# EAGLE design 32u4 Simple Breakout (EAGLE 7.4.0)
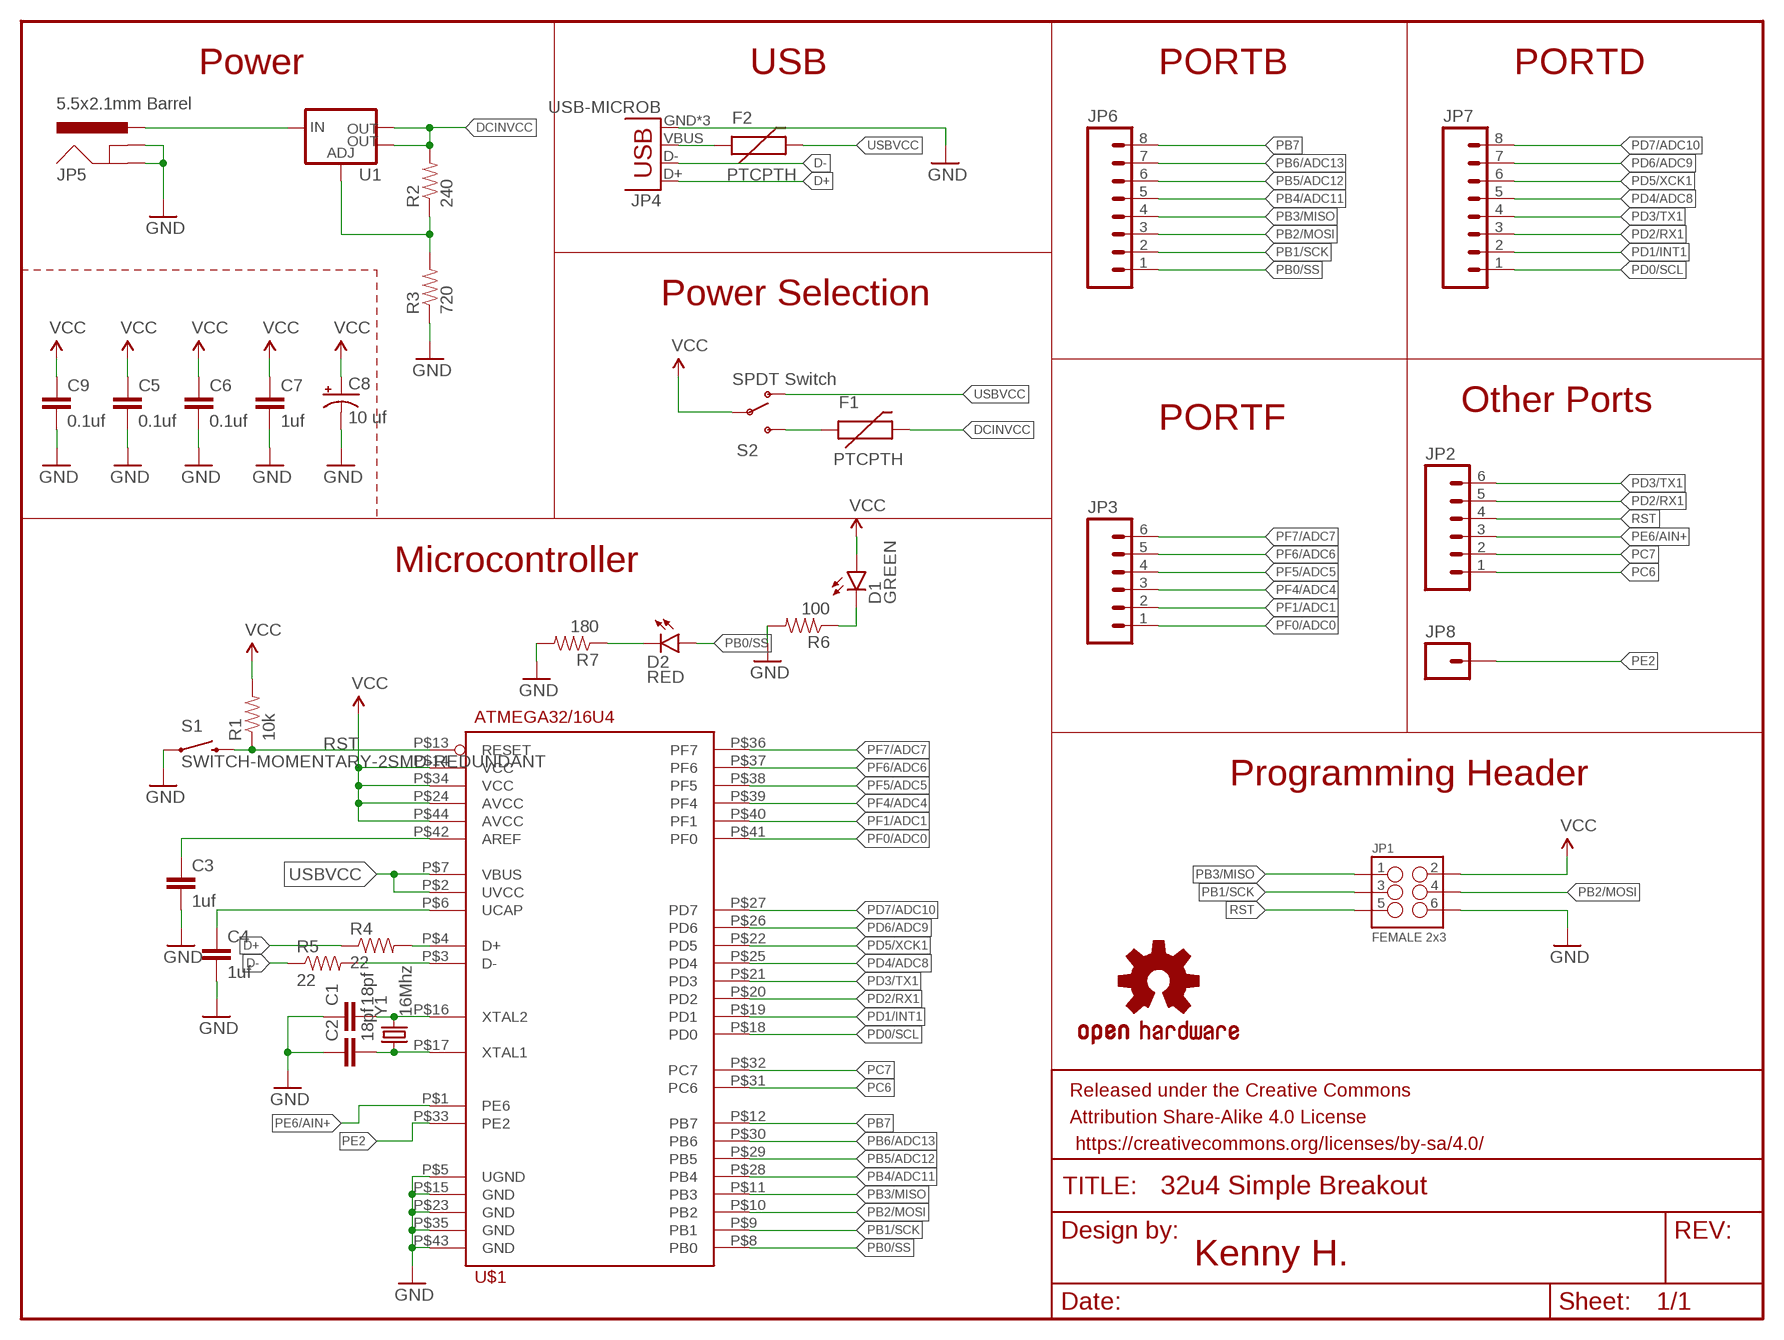
[diagram p0: schematic, sheet 1]

## Parts
C1  18pf  CAP0603-CAP  [0603-CAP]
C2  18pf  CAP0603-CAP  [0603-CAP]
C3  1uf  CAP0603-CAP  [0603-CAP]
C4  1uf  CAP0603-CAP  [0603-CAP]
C5  0.1uf  CAP0603-CAP  [0603-CAP]
C6  0.1uf  CAP0603-CAP  [0603-CAP]
C7  1uf  CAP0603-CAP  [0603-CAP]
C8  10 uf  CAP_POLPTH2  [CPOL-RADIAL-10UF-25V]
C9  0.1uf  CAP0603-CAP  [0603-CAP]
D1  GREEN  LED-GREEN1206  [LED-1206]
D2  RED  LED-RED1206  [LED-1206]
F1  PTCPTH  [PTC]
F2  PTCPTH  [PTC]
FRAME1  FRAME-LETTER  [CREATIVE_COMMONS]
JP1  FEMALE 2x3  M03X2FEMALE  [2X3]
JP2  M06FEMALE_LOCK  [1X06_FEMALE_LOCK.010]
JP3  M06FEMALE_LOCK  [1X06_FEMALE_LOCK.010]
JP4  USB-MICROB  [USB-MICROB]
JP5  5.5x2.1mm Barrel  POWER_JACKSMD  [POWER_JACK_SMD]
JP6  M08FEMALE_LOCK  [1X08_FEMALE_LOCK]
JP7  M08FEMALE_LOCK  [1X08_FEMALE_LOCK]
JP8  M01PTH  [1X01]
LOGO1  OSHW-LOGOM  [OSHW-LOGO-M]
R1  10k  RESISTOR0603-RES  [0603-RES]
R2  240  RESISTOR0603-RES  [0603-RES]
R3  720  RESISTOR0603-RES  [0603-RES]
R4  22  RESISTOR0603-RES  [0603-RES]
R5  22  RESISTOR0603-RES  [0603-RES]
R6  100  RESISTOR1206  [1206]
R7  180  RESISTOR1206  [1206]
S1  SWITCH-MOMENTARY-2SMD-REDUNDANT  [TACTILE-SWITCH-SMD]
S2  SPDT Switch  SWITCH-SPDT-SMD-A  [SWITCH-SPST-SMD-A]
U1  V_REG_LM1117SOT223  [SOT223]
U$1  ATMEGA32/16U4  [TQFP_44_0.8MM]
Y1  16Mhz  CRYSTAL5X3  [CRYSTAL-SMD-5X3]

## Nets
D+: JP4.D+ R4.1
D-: JP4.D- R5.1
DCINVCC: F1.P$2 R2.2 U1.2(OUT) U1.4(OUT)
GND: C1.1 C2.1 C3.2 C4.2 C5.2 C6.2 C7.2 C8.2(-) C9.2 JP1.6 JP4.GND JP4.MT1(GND) JP4.MT2(GND) JP5.GND(GNDBREAK) JP5.P$4(GND) R3.1 R6.2 R7.2 S1.1 S1.2 U$1.P$5(UGND) U$1.P$15(GND) U$1.P$23(GND) U$1.P$35(GND) U$1.P$43(GND)
N$1: C3.1 U$1.P$42(AREF)
N$2: C4.1 U$1.P$6(UCAP)
N$3: R2.1 R3.2 U1.1(ADJ)
N$4: JP5.VIN0(PWR) U1.3(IN)
N$5: R4.2 U$1.P$4(D+)
N$6: R5.2 U$1.P$3(D-)
N$7: F2.P$1 JP4.VBUS
N$8: F1.P$1 S2.3(S)
N$9: D1.C R6.1
N$10: D2.C R7.1
PB0/SS: D2.A JP6.1 U$1.P$8(PB0)
PB1/SCK: JP1.3 JP6.2 U$1.P$9(PB1)
PB2/MOSI: JP1.4 JP6.3 U$1.P$10(PB2)
PB3/MISO: JP1.1 JP6.4 U$1.P$11(PB3)
PB4/ADC11: JP6.5 U$1.P$28(PB4)
PB5/ADC12: JP6.6 U$1.P$29(PB5)
PB6/ADC13: JP6.7 U$1.P$30(PB6)
PB7: JP6.8 U$1.P$12(PB7)
PC6: JP2.1 U$1.P$31(PC6)
PC7: JP2.2 U$1.P$32(PC7)
PD0/SCL: JP7.1 U$1.P$18(PD0)
PD1/INT1: JP7.2 U$1.P$19(PD1)
PD2/RX1: JP2.5 JP7.3 U$1.P$20(PD2)
PD3/TX1: JP2.6 JP7.4 U$1.P$21(PD3)
PD4/ADC8: JP7.5 U$1.P$25(PD4)
PD5/XCK1: JP7.6 U$1.P$22(PD5)
PD6/ADC9: JP7.7 U$1.P$26(PD6)
PD7/ADC10: JP7.8 U$1.P$27(PD7)
PE2: JP8.1 U$1.P$33(PE2)
PE6/AIN+: JP2.3 U$1.P$1(PE6)
PF0/ADC0: JP3.1 U$1.P$41(PF0)
PF1/ADC1: JP3.2 U$1.P$40(PF1)
PF4/ADC4: JP3.3 U$1.P$39(PF4)
PF5/ADC5: JP3.4 U$1.P$38(PF5)
PF6/ADC6: JP3.5 U$1.P$37(PF6)
PF7/ADC7: JP3.6 U$1.P$36(PF7)
RST: JP1.5 JP2.4 R1.1 S1.3 S1.4 U$1.P$13(RESET)
USBVCC: F2.P$2 S2.1(O) U$1.P$2(UVCC) U$1.P$7(VBUS)
VCC: C5.1 C6.1 C7.1 C8.1(+) C9.1 D1.A JP1.2 R1.2 S2.2(P) U$1.P$14(VCC) U$1.P$24(AVCC) U$1.P$34(VCC) U$1.P$44(AVCC)
XTAL1: C2.2 U$1.P$17(XTAL1) Y1.1
XTAL2: C1.2 U$1.P$16(XTAL2) Y1.3

## Notes on the sheet
- Power | USB | PORTB | PORTD
- Power Selection
- Other Ports
- PORTF
- Microcontroller
- Programming Header
- Kenny H.

## Library data of the parts
C1-C7 C9 = SparkFun-Capacitors:CAP: Capacitor Standard 0603 ceramic capacitor, and 0.1" leaded capacitor.
C8 = SparkFun-Capacitors:CAP_POL: Capacitor Polarized These are standard SMD and PTH capacitors. Normally 10uF, 47uF, and 100uF in electrolytic and tantalum varieties. Always verify the external diameter of the through hole cap, it varies with capacity, voltage, and manufacturer. The EIA devices should be standard.
D1 = SparkFun-LED:LED-GREEN: Various green LEDs Green LEDs used in SFE Production 0603- DIO-00821 LARGE- DIO-00862 LILYPAD- DIO-09910; PROD_ID: DIO-00862
D2 = SparkFun-LED:LED-RED: Assorted Red LEDs LilyPad 1206- DIO-09912 1206- DIO-00809 0603- DIO-00819 "SMART" means more efficient and expensive; PROD_ID: DIO-09912
F1 F2 = SparkFun-PowerIC:PTC: Resettable Fuse PTC Resettable Fuse. Spark Fun Electronics SKU : COM-08357
FRAME1 = SparkFun-Aesthetics:FRAME-LETTER: Schematic Frame Standard 8.5x11 US Letter frame
JP1 = SparkFun-Connectors:M03X2: 2x3 .1" header. Shrouded, with keying- CONN-10681 SMT- CONN-11415 Pogo pins- HW-11044; PROD_ID: CONN-11566
JP2 JP3 = SparkFun-Connectors:M06: Header 6 Standard 6-pin 0.1" header. Use with straight break away headers (SKU : PRT-00116), right angle break away headers (PRT-00553), swiss pins (PRT-00743), machine pins (PRT-00117), and female headers (PRT-00115). Molex polarized connector foot print use with SKU : PRT-08094 with associated crimp pins and housings. NOTES ON THE VARIANTS LOCK and LOCK_LONGPADS... This footprint was designed to help hold the alignment of a through-hole component (i.e. 6-pin header) while soldering it into place. You may notice that each hole has been shifted either up or down by 0.005 of an inch from it's more standard position (which is a perfectly straight line). This slight alteration caused the pins (the squares in the middle) to touch the edges of the holes. Because they are alternating, it causes a "brace" to hold the component in place. 0.005 has proven to be the perfect amount of "off-center" position when using our standard breakaway headers. Although looks a little odd when you look at the bare footprint, once you have a header in there, the alteration is very hard to notice. Also,if you push a header all the way into place, it is covered up entirely on the bottom side. This idea of altering the position of holes to aid alignment will be further integrated into the Sparkfun Library for other footprints. It can help hold any component with 3 or more connection pins.
JP4 = SparkFun-Connectors:USB: USB Connectors USB-B-PTH is fully proven SKU : PRT-00139/CONN-08278 USB-miniB is fully proven SKU : PRT-00587 USB-A-PCB is untested. USB-A-H is throughly reviewed, but untested. Spark Fun Electronics SKU : PRT-00437 USB-B-SMT is throughly reviewed, but untested. Needs silkscreen touching up. USB-A-S has not been used/tested USB-MB-H has not been used/tested USB-MICROB has been used. CONN-09505; PROD_ID: CONN-09505
JP5 = SparkFun-Connectors:POWER_JACK: Power Jack This is the standard 5.5mm barrel jack for power. The PTH is the most common, proven, reliable, footprint. The Slot footprint only works if the mill layer is transmitted to the PCB fab house so be warned. Mating wall wart : TOL-00298 (and others); PROD_ID: CONN-08106; SF_ID: PRT-12748
JP6 JP7 = SparkFun-Connectors:M08: Header 8 Standard 8-pin 0.1" header. Use with straight break away headers (SKU : PRT-00116), right angle break away headers (PRT-00553), swiss pins (PRT-00743), machine pins (PRT-00117), and female headers (PRT-00115).
JP8 = SparkFun-Connectors:M01: Header 1 Standard 1-pin 0.1" header. Use with straight break away headers (SKU : PRT-00116), right angle break away headers (PRT-00553), swiss pins (PRT-00743), machine pins (PRT-00117), and female headers (PRT-00115). SMTSO-256-ET is a "flush mount" nut for a 4-40 screw. The older package used to be too tight, and did not allow it to sit properly thru the drill hit. The latest (0.165DIA) fits nice and snug.
LOGO1 = SparkFun-Aesthetics:OSHW-LOGO: Open Source Hardware Logo This logo indicates the piece of hardware it is found on incorporates a OSHW license and/or adheres to the definition of open source hardware found here: http://freedomdefined.org/OSHW
R1-R3 = SparkFun-Passives:RESISTOR: Resistor Basic schematic elements and footprints for 0603, 1206, and PTH resistors.
R4-R7 = SparkFun-Resistors:RESISTOR: Resistor Basic schematic elements and footprints for 0603, 1206, and PTH resistors.
S1 = SparkFun-Electromechanical:SWITCH-MOMENTARY-2: Various NO switches- pushbuttons, reed, etc; PROD_ID: SWCH-08247
S2 = SparkFun-Electromechanical:SWITCH-SPDT: SPDT Switch Simple slide switch, Spark Fun Electronics SKU : COM-00102 DPDT SMT slide switch, AYZ0202, SWCH-08179
U1 = SparkFun-PowerIC:V_REG_LM1117: Voltage Regulator LM1117 Standard adjustable voltage regulator but in SMD form. Spark Fun Electronics SKU : COM-00595; PROD_ID: VREG-08170
U$1 = Kenny:ATMEGA32/16U4: ATmega32u4 and 16u4 Atmel's ATmega32u4 and 16u4 -This is Atmel's 32u4 in a TQFP44 package. -Made by Kenny H. -Created for a 32u4 breakout 8-bit microcontroller with 16/32K bytes of ISP flash and USB Controller
Y1 = SparkFun-FreqCtrl:CRYSTAL: Various standard crystals. Proven footprints.; PROD_ID: XTAL-08218

## Board
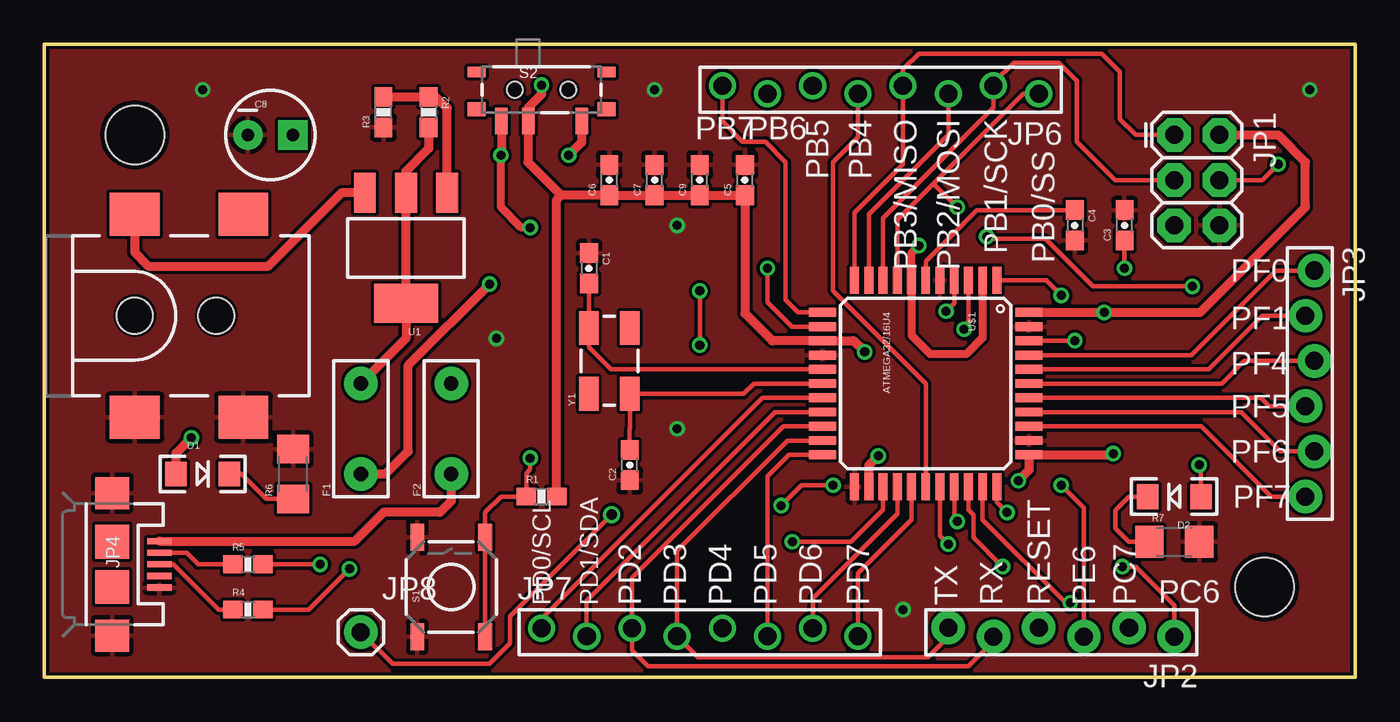
[diagram p1: board, top side]
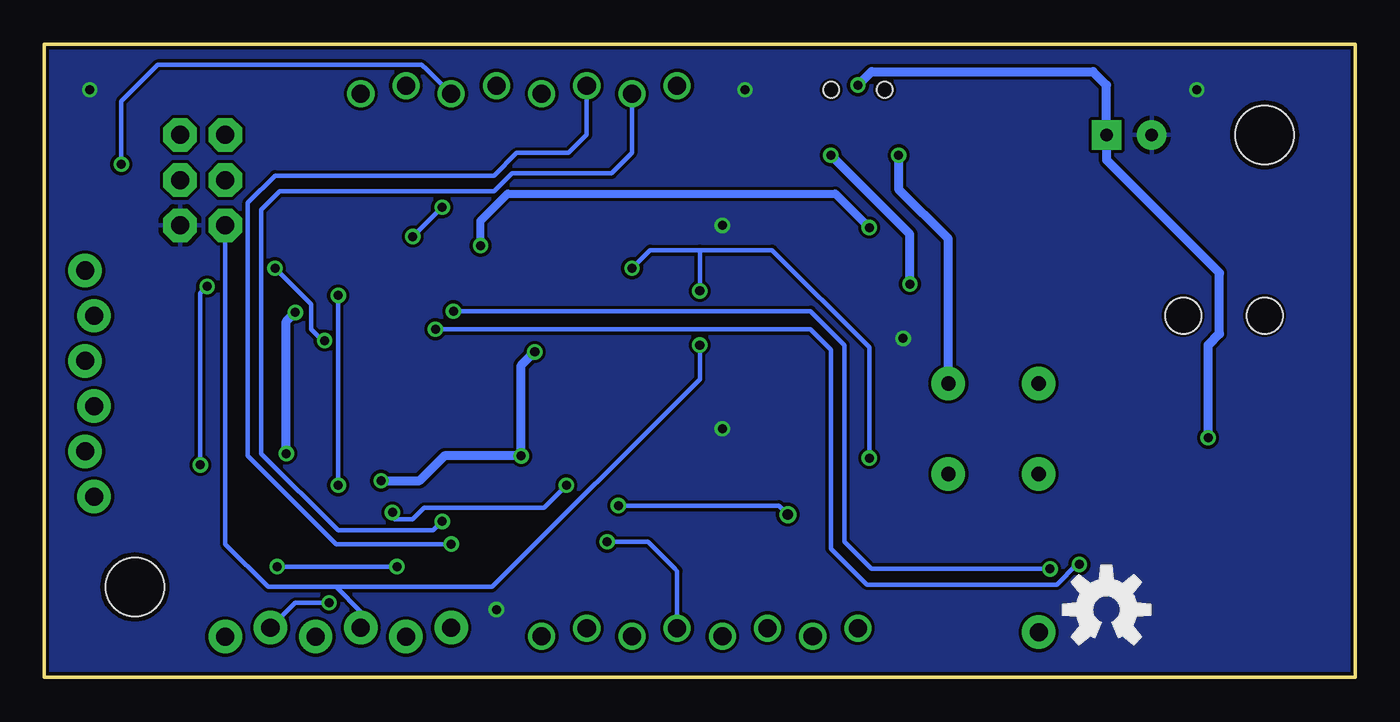
[diagram p2: board, bottom side, seen from below]

Size 73.66 x 35.56 mm. Coordinates in mm from the lower left corner, seen from the top.
Outline: 0,0 73.66,0 73.66,35.56 0,35.56 0,0
Copper layers (1*16): Top 0.035mm / dielectric 1.5mm / Bottom 0.035mm
Design rules "SparkFun-2-layer-TIGHT": minimum track width 7mil, minimum drill 15mil, track to track 7mil, track to pad 7mil, pad to pad 7mil, via to via 7mil, smd to smd 7mil, copper to edge 7mil, drill to drill 7mil, minimum pad ring 7mil, minimum via ring 7mil, stop-mask expansion 4mil, vias tented up to drill 20mil, thermal gap 10mil

### Footprints (pad centres in the part's own frame; a part is rotated, then mirrored left to right if it is on the bottom)
0603-CAP = smd 1.1 x 1: 1 -0.85,0; 2 0.85,0
CPOL-RADIAL-10UF-25V = drill 0.7 pad 1.651 square: 1 1.27,0 | drill 0.7 pad 1.651: 2 -1.27,0
LED-1206 = smd 1.2 x 1.4: A -1.5,0; C 1.5,0
PTC = drill 0.8 pad 1.88: P$1 -2.54,0; P$2 2.54,0
2X3 = drill 1.016 pad 1.88 octagon: 1 0,0; 2 0,2.54; 3 2.54,0; 4 2.54,2.54; 5 5.08,0; 6 5.08,2.54
1X06_FEMALE_LOCK.010 = drill 1.016 pad 1.88: 1 0,0.254; 2 2.54,-0.254; 3 5.08,0.254; 4 7.62,-0.254; 5 10.16,0.254; 6 12.7,-0.254
USB-MICROB = smd 0.35 x 1.4: D+ 0,2.65; D- -0.65,2.65; GND 1.3,2.65; ID 0.65,2.65; VBUS -1.3,2.65 | smd 1.8 x 1.9: MT1 -4,0; MT2 4,0 | smd 1.9 x 1.9: P$1 -1.27,0; P$2 1.27,0
POWER_JACK_SMD = smd 2.8 x 2.4: GND 0,-5.7; P$4 6.1,-5.7; VIN0 0,5.7; VIN1 6.1,5.7 | hole 2.032: 0,0; 4.572,0
1X08_FEMALE_LOCK = drill 1.016: 1 0,0.229; 2 2.54,-0.229; 3 5.08,0.229; 4 7.62,-0.229; 5 10.16,0.229; 6 12.7,-0.229; 7 15.24,0.229; 8 17.78,-0.229
1X01 = drill 1.016 pad 1.88: 1 0,0
0603-RES = smd 1.1 x 1: 1 -0.85,0; 2 0.85,0
1206 = smd 1.6 x 1.8: 1 -1.4,0; 2 1.4,0
TACTILE-SWITCH-SMD = smd 1.524 x 0.762: 1 -2.794,1.905; 2 2.794,1.905; 3 -2.794,-1.905; 4 2.794,-1.905
SWITCH-SPST-SMD-A = smd 0.7 x 1.5: 1 -2.25,-1.75; 2 -0.75,-1.75; 3 2.25,-1.75 | smd 1 x 0.6: GND1 -3.65,1; GND3 3.65,1 | smd 1 x 0.8: GND2 -3.65,-1.1; GND4 3.65,-1.1 | hole 0.9: -1.5,0; 1.5,0
SOT223 = smd 1.219 x 2.235: 1 -2.311,-3.099; 2 0,-3.099; 3 2.311,-3.099 | smd 3.6 x 2.2: 4 0,3.099
TQFP_44_0.8MM = smd 1.5 x 0.5: P$1 -5.8,4; P$2 -5.8,3.2; P$3 -5.8,2.4; P$4 -5.8,1.6; P$5 -5.8,0.8; P$6 -5.8,0; P$7 -5.8,-0.8; P$8 -5.8,-1.6; P$9 -5.8,-2.4; P$10 -5.8,-3.2; P$11 -5.8,-4; P$23 5.8,-4; P$24 5.8,-3.2; P$25 5.8,-2.4; P$26 5.8,-1.6; P$27 5.8,-0.8; P$28 5.8,0; P$29 5.8,0.8; P$30 5.8,1.6; P$31 5.8,2.4; P$32 5.8,3.2; P$33 5.8,4 | smd 0.5 x 1.5: P$12 -4,-5.8; P$13 -3.2,-5.8; P$14 -2.4,-5.8; P$15 -1.6,-5.8; P$16 -0.8,-5.8; P$17 0,-5.8; P$18 0.8,-5.8; P$19 1.6,-5.8; P$20 2.4,-5.8; P$21 3.2,-5.8; P$22 4,-5.8; P$34 4,5.8; P$35 3.2,5.8; P$36 2.4,5.8; P$37 1.6,5.8; P$38 0.8,5.8; P$39 0,5.8; P$40 -0.8,5.8; P$41 -1.6,5.8; P$42 -2.4,5.8; P$43 -3.2,5.8; P$44 -4,5.8
STAND-OFF = hole 3.302: 0,0
CRYSTAL-SMD-5X3 = smd 1.9 x 1.1: 1 -1.85,-1.15; 2 1.85,-1.15; 3 1.85,1.15; 4 -1.85,1.15

### Placement (x,y rotation side)
C1  30.61,22.99 270 top
C2  32.89,11.94 90 top
C3  60.71,25.4 90 top
C4  57.91,25.4 270 top
C5  39.37,27.94 90 top
C6  31.75,27.94 90 top
C7  34.29,27.94 90 top
C8  12.7,30.48 0 top
C9  36.83,27.94 90 top
D1  8.89,11.43 0 top
D2  63.5,10.16 180 top
F1  17.78,13.97 90 top
F2  22.86,13.97 90 top
FRAME1  24.13,-8.89 0 top  (outside the outline)
JP1  63.5,30.48 270 top
JP2  63.5,2.54 180 top
JP3  71.12,22.86 270 top
JP4  3.81,6.35 270 top
JP5  5.08,20.32 0 top
JP6  55.88,33.02 180 top
JP7  27.94,2.54 0 top
JP8  17.78,2.54 0 top
LOGO1  13.97,3.81 0 bottom
R1  27.94,10.16 0 top
R2  21.59,31.75 270 top
R3  19.05,31.75 90 top
R4  11.43,3.81 0 top
R5  11.43,6.35 0 top
R6  13.97,11.43 90 top
R7  63.5,7.62 0 top
S1  22.86,5.08 90 top
S2  27.94,33.02 0 top
U1  20.32,24.13 180 top
U$1  49.53,16.51 270 top
U$3  [STAND-OFF]  5.08,30.48 0 top
U$4  [STAND-OFF]  68.58,5.08 0 top
Y1  31.75,17.78 90 top

### Tracks (layer width: path | path; a pad name or v marks a point on that pad's centre or on a via)
D+
  Top 0.254: JP4.D+ 7.24,6.35 9.78,3.81 R4.1
D-
  Top 0.254: JP4.D- 7.99,7 8.64,6.35 R5.1
DCINVCC
  Top 0.508: F1.P$2 20.32,19.05 U1.4 U1.2 20.32,28.45 21.59,29.72 R2.2
GND  (via drill 0.51)
  other vias: 8.89,33.02 35.56,13.97 71.12,33.02 34.29,33.02 48.26,3.81 25.4,19.05 35.56,25.4
  pour Bottom: 0,35.56 73.66,35.56 73.66,0 0,0
  pour Top: 0,35.56 73.66,35.56 73.66,0 0,0
N$1  (via drill 0.51)
  Top 0.254: U$1.P$42 v57.9,18.91 v57.91,18.92 | C3.1 v60.71,22.99
  Bottom 0.254: v57.91,18.92 58.04,18.92 58.67,19.56 58.67,20.95 v60.71,22.99
N$2
  Top 0.254: U$1.P$6 49.53,23.37 52.41,26.25 C4.1
N$3
  Top 0.508: U1.1 22.63,31.98 22.01,32.6 R2.1 R3.2
N$4
  Top 0.508: JP5.VIN0 5.08,23.88 5.84,23.11 12.57,23.11 16.69,27.23 U1.3
N$5  (via drill 0.51)
  Top 0.254: R4.2 14.86,3.81 v17.14,6.1 | U$1.P$4 51.13,21.03 v50.67,20.57
  Bottom 0.254: v17.14,6.1 27.18,6.1 28.7,7.62 28.7,18.67 30.61,20.57 v50.67,20.57
N$6  (via drill 0.51)
  Top 0.254: R5.2 v15.49,6.35 | U$1.P$3 51.93,19.8 v51.69,19.56
  Bottom 0.254: v15.49,6.35 15.62,6.35 16.76,5.21 27.43,5.21 29.46,7.24 29.46,18.41 30.61,19.56 v51.69,19.56
N$7
  Top 0.508: JP4.VBUS 17.43,7.65 19.05,9.27 22.23,9.27 22.86,9.91 F2.P$1
N$8  (via drill 0.51)
  Top 0.508: F1.P$1 19.18,11.43 20.45,12.7 20.45,17.53 v25.02,22.1 | v29.46,29.34 30.19,30.06 S2.3
  Bottom 0.508: v25.02,22.1 25.02,24.89 v29.46,29.34
N$9
  Top 0.254: D1.C 11.05,11.43 12.45,10.03 R6.1
N$10
  Top 0.254: R7.1 60.96,7.62 60.2,8.38 60.2,9.4 60.96,10.16 D2.C
PB0/SS  (via drill 0.51)
  Top 0.254: U$1.P$8 47.93,25.7 49.97,27.75 | 49.97,27.75 55.02,32.79 JP6.1 | D2.A 65,11.84 v64.9,11.94 | v64.52,21.97 58.93,21.97 56.26,24.64 53.09,24.64 v52.96,24.77 | v51.31,26.42 49.97,27.75
  Bottom 0.254: v64.9,11.94 64.9,21.59 v64.52,21.97 | v52.96,24.77 v51.31,26.42
PB1/SCK
  Top 0.254: U$1.P$9 47.13,25.79 53.34,32 JP6.2 | JP1.3 60.2,27.94 58.04,30.1 58.04,33.53 57.02,34.54 54.48,34.54 53.34,33.4 JP6.2 | JP6.2 53.34,33.27
PB2/MOSI  (via drill 0.51)
  Top 0.254: U$1.P$10 46.33,26.01 50.8,30.48 JP6.3 | JP1.4 68.45,27.94 v69.34,28.83
  Bottom 0.254: v69.34,28.83 69.34,32.38 67.31,34.42 52.45,34.42 52.32,34.29 52.3,34.29 JP6.3
PB3/MISO
  Top 0.254: U$1.P$11 45.53,26.1 48.26,28.83 JP6.4 48.26,34.16 49.15,35.05 59.44,35.05 60.45,34.04 60.45,31.37 61.34,30.48 JP1.1
PB4/ADC11
  Top 0.254: U$1.P$28 49.53,16.51 44.32,21.72 44.32,28.96 45.72,30.35 JP6.5
PB5/ADC12  (via drill 0.51)
  Top 0.254: U$1.P$29 50.33,7.96 v50.8,7.49
  Bottom 0.254: v50.8,7.49 57.28,7.49 62.23,12.45 62.23,26.67 60.71,28.19 48.39,28.19 47.12,29.46 44.2,29.46 43.18,30.48 JP6.6
PB6/ADC13  (via drill 0.51)
  Top 0.254: U$1.P$30 51.13,8.94 v51.31,8.76
  Bottom 0.254: v51.31,8.76 51.82,8.26 57.15,8.26 61.47,12.57 61.47,26.29 60.45,27.3 48.39,27.3 47.37,28.32 41.78,28.32 40.64,29.46 JP6.7
PB7
  Top 0.254: U$1.P$12 42.35,20.51 41.66,21.21 41.66,28.96 40.51,30.1 39.24,30.1 38.1,31.24 JP6.8
PC6  (via drill 0.51)
  Top 0.254: U$1.P$31 51.93,9.41 52.2,9.14 52.2,7.87 v53.85,6.22 | v60.58,6.22 61.34,6.22 63.5,4.06 JP2.1
  Bottom 0.254: v53.85,6.22 v60.58,6.22
PC7  (via drill 0.51)
  Top 0.254: U$1.P$32 52.73,8.87 57.4,4.19 v57.66,4.19
  Bottom 0.254: JP2.2 59.56,4.19 v57.66,4.19
PD0/SCL
  Top 0.254: JP7.1 27.94,3.3 40.35,15.71 U$1.P$18
PD1/INT1
  Top 0.254: JP7.2 30.48,4.32 41.07,14.91 U$1.P$19
PD2/RX1
  Top 0.254: U$1.P$20 41.54,14.11 33.02,5.59 JP7.3 33.02,1.52 33.91,0.64 51.94,0.64 53.34,2.03 JP2.5
PD3/TX1
  Top 0.254: U$1.P$21 41.76,13.31 35.56,7.11 JP7.4 36.34,1.54 36.6,1.27 36.73,1.14 49.66,1.14 50.8,2.29 JP2.6
PD4/ADC8  (via drill 0.51)
  Top 0.254: U$1.P$25 47.13,9.41 45.34,7.62 v42.04,7.62
  Bottom 0.254: v42.04,7.62 39.75,7.62 38.23,6.1 38.1,5.97 JP7.5
PD5/XCK1
  Top 0.254: U$1.P$22 41.85,12.51 40.89,11.56 40.64,11.3 JP7.6
PD6/ADC9
  Top 0.254: U$1.P$26 47.93,9.2 43.18,4.45 JP7.7
PD7/ADC10
  Top 0.254: JP7.8 45.72,5.84 48.73,8.85 U$1.P$27
PE2  (via drill 0.51, 0.6)
  Top 0.254: U$1.P$33 53.53,9.84 v54.1,9.27 | v44.32,10.79 42.55,10.79 v41.4,9.65 | JP8.1 19.56,0.76 25.02,0.76 26.16,1.91 26.16,3.43 v31.88,9.14
  Bottom 0.254: v54.1,9.27 54.1,9.02 53.98,8.89 52.96,8.89 52.32,9.53 45.59,9.53 v44.32,10.79 | v41.4,9.65 32.38,9.65 v31.88,9.14
PE6/AIN+  (via drill 0.51)
  Top 0.254: JP2.3 58.42,9.53 v57.15,10.79 | U$1.P$1 56.3,22.31 v57.15,21.46
  Bottom 0.254: v57.15,10.79 v57.15,21.46
PF0/ADC0
  Top 0.254: U$1.P$41 64.47,18.11 69.22,22.86 JP3.1
PF1/ADC1
  Top 0.254: U$1.P$40 65.44,17.31 68.45,20.32 JP3.2
PF4/ADC4
  Top 0.254: U$1.P$39 66.17,16.51 67.44,17.78 JP3.3
PF5/ADC5
  Top 0.254: U$1.P$38 68.36,15.71 68.83,15.24 JP3.4
PF6/ADC6
  Top 0.254: U$1.P$37 67.26,14.91 69.47,12.7 JP3.5
PF7/ADC7
  Top 0.254: U$1.P$36 65.01,14.11 68.96,10.16 JP3.6
RST  (via drill 0.51)
  Top 0.254: S1.3 S1.4 24.77,9.27 25.65,10.16 R1.1 27.09,11.47 27.3,11.68 v27.3,12.32 | U$1.P$13 42.01,19.71 40.64,21.08 v40.64,22.99 | v36.83,18.67 v36.83,21.72
  Bottom 0.254: v40.64,22.99 39.62,24 36.83,24 | 36.83,24 32.77,24 27.3,18.54 v27.3,12.32 | JP1.5 63.5,7.49 61.09,5.08 57.28,5.08 | 57.28,5.08 55.88,3.68 JP2.4 | 57.28,5.08 48.51,5.08 36.83,16.76 v36.83,18.67 | v36.83,21.72 36.83,24
USBVCC  (via drill 0.51)
  Top 0.445: U$1.P$2 52.73,19.07 51.82,18.16 49.78,18.16 48.73,19.21 U$1.P$7 48.73,23.84 v49.15,24.26 | v27.3,25.27 26.8,25.27 25.65,26.42 v25.65,29.34
  Top 0.508: S2.1 25.69,29.37 v25.65,29.34
  Bottom 0.445: v49.15,24.26 49.15,25.65 47.62,27.18 29.21,27.18 v27.3,25.27
  Bottom 0.508: F2.P$2 22.86,24.64 25.65,27.43 v25.65,29.34
VCC  (via drill 0.51)
  Top 0.508: 29.04,27.09 C6.1 C7.1 C9.1 C5.1 39.37,20.45 40.91,18.91 U$1.P$14 45.45,18.91 45.47,18.92 v46.1,18.29 | 29.04,27.09 27.18,28.96 27.19,28.97 S2.2 27.19,32.02 27.94,32.77 v27.94,33.27 | R1.2 28.79,26.84 29.04,27.09 | U$1.P$44 v59.56,20.51 64.96,20.51 70.87,26.42 70.87,28.96 69.34,30.48 JP1.2 | v60.07,12.57 60.01,12.51 U$1.P$34 55.33,11.64 v54.74,11.05 | U$1.P$24 46.33,11.91 v46.86,12.45 | D1.A 7.39,12.6 v8.26,13.46
  Bottom 0.508: v60.07,12.57 60.07,20 v59.56,20.51 | v54.74,11.05 52.58,11.05 51.18,12.45 v46.86,12.45 46.86,17.53 v46.1,18.29 | v8.26,13.46 8.26,18.67 7.62,19.3 7.62,22.73 13.97,29.08 C8.1 13.97,33.27 14.73,34.04 27.18,34.04 v27.94,33.27
XTAL1
  Top 0.254: C2.2 32.89,13.97 32.9,13.98 Y1.1 39.3,15.93 39.88,16.51 U$1.P$17
XTAL2
  Top 0.254: C1.2 Y1.3 30.6,18.55 31.84,17.31 U$1.P$16

### Text on the board
tPlace: PB5 | PB4 | PB3/MISO | PB2/MOSI | PB1/SCK | PB7 | PB6 | PB0/SS | PF0 | PF1 | PF4 | PF5 | PF6 | PF7 | PD0/SCL | PD1/SDA | PD2 | PD3 | PD4 | PD5 | PD6 | PD7 | TX | RX | RESET | PE6 | PC7 | PC6